# Altium schematic sheet LED_Array.SchDoc
size A4
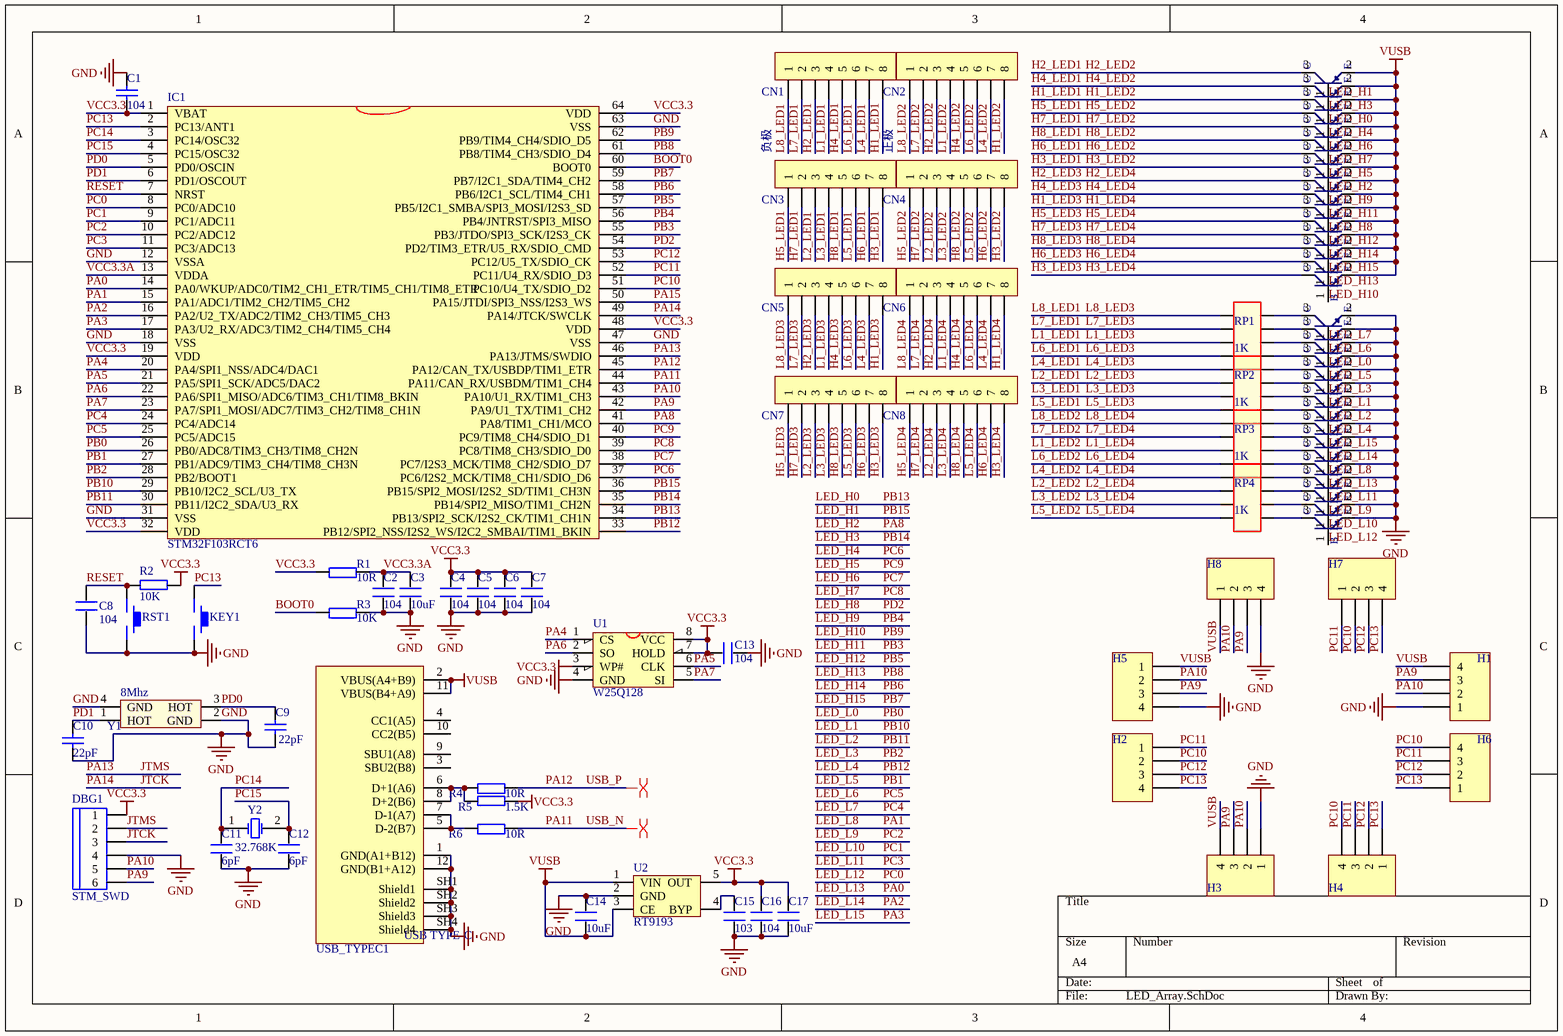
[diagram p0: LED_Array.SchDoc]

## Parts
C1  104  [C 0603_L]
C2  104  [C 0603_L]
C3  10uF  [C 0603_L]
C4  104  [C 0603_L]
C5  104  [C 0603_L]
C6  104  [C 0603_L]
C7  104  [C 0603_L]
C8  104  [C 0603_L]
C9  22pF  [C 0603_L]
C10  22pF  [C 0603_L]
C11  6pF  [C 0603_L]
C12  6pF  [C 0603_L]
C13  104  [C 0603_L]
C14  10uF  [C 0603_L]
C15  103  [C 0603_L]
C16  104  [C 0603_L]
C17  10uF  [C 0603_L]
CN1  HDR-1X8  [HDR2.54-Y-LI-8P]  (value not drawn)
CN2  HDR-1X8  [HDR2.54-Y-LI-8P]  (value not drawn)
CN3  HDR-1X8  [HDR2.54-Y-LI-8P]  (value not drawn)
CN4  HDR-1X8  [HDR2.54-Y-LI-8P]  (value not drawn)
CN5  HDR-1X8  [HDR2.54-Y-LI-8P]  (value not drawn)
CN6  HDR-1X8  [HDR2.54-Y-LI-8P]  (value not drawn)
CN7  HDR-1X8  [HDR2.54-Y-LI-8P]  (value not drawn)
CN8  HDR-1X8  [HDR2.54-Y-LI-8P]  (value not drawn)
DBG1  STM_SWD  [SH1.0 S-W-6P]
H1  Header 4  [HDR2.54-WI-4P]  (value not drawn)
H2  Header 4  [HDR2.54-WI-4P]  (value not drawn)
H3  Header 4  [HDR2.54-WI-4P]  (value not drawn)
H4  Header 4  [HDR2.54-WI-4P]  (value not drawn)
H5  Header 4  [HDR2.54-WI-4P]  (value not drawn)
H6  Header 4  [HDR2.54-WI-4P]  (value not drawn)
H7  Header 4  [HDR2.54-WI-4P]  (value not drawn)
H8  Header 4  [HDR2.54-WI-4P]  (value not drawn)
IC1  STM32F103RCT6  [LQFP64 10X10_L]
KEY1  KEY-SMD  [TSW SMD-3*6*2.5]  (value not drawn)
Q1  8550  [SOT23-3L]  (value not drawn)
Q2  8550  [SOT23-3L]  (value not drawn)
Q3  8550  [SOT23-3L]  (value not drawn)
Q4  8550  [SOT23-3L]  (value not drawn)
Q5  8550  [SOT23-3L]  (value not drawn)
Q6  8550  [SOT23-3L]  (value not drawn)
Q7  8550  [SOT23-3L]  (value not drawn)
Q8  8550  [SOT23-3L]  (value not drawn)
Q9  8550  [SOT23-3L]  (value not drawn)
Q10  8550  [SOT23-3L]  (value not drawn)
Q11  8550  [SOT23-3L]  (value not drawn)
Q12  8550  [SOT23-3L]  (value not drawn)
Q13  8550  [SOT23-3L]  (value not drawn)
Q14  8550  [SOT23-3L]  (value not drawn)
Q15  8550  [SOT23-3L]  (value not drawn)
Q16  8550  [SOT23-3L]  (value not drawn)
Q17  8050  [SOT23-3L]  (value not drawn)
Q18  8050  [SOT23-3L]  (value not drawn)
Q19  8050  [SOT23-3L]  (value not drawn)
Q20  8050  [SOT23-3L]  (value not drawn)
Q21  8050  [SOT23-3L]  (value not drawn)
Q22  8050  [SOT23-3L]  (value not drawn)
Q23  8050  [SOT23-3L]  (value not drawn)
Q24  8050  [SOT23-3L]  (value not drawn)
Q25  8050  [SOT23-3L]  (value not drawn)
Q26  8050  [SOT23-3L]  (value not drawn)
Q27  8050  [SOT23-3L]  (value not drawn)
Q28  8050  [SOT23-3L]  (value not drawn)
Q29  8050  [SOT23-3L]  (value not drawn)
Q30  8050  [SOT23-3L]  (value not drawn)
Q31  8050  [SOT23-3L]  (value not drawn)
Q32  8050  [SOT23-3L]  (value not drawn)
R1  10R  [R 0603_L]
R2  10K  [R 0603_L]
R3  10K  [R 0603_L]
R4  10R  [R 0603_L]
R5  1.5K  [R 0603_L]
R6  10R  [R 0603_L]
RP1  1K  [P_pack]
RP2  1K  [P_pack]
RP3  1K  [P_pack]
RP4  1K  [P_pack]
RST1  KEY-SMD  [TSW SMD-3*6*2.5]  (value not drawn)
U1  W25Q128  [SOP8W_L]
U2  RT9193  [SOT23-5L]
USB_TYPEC1  USB TypeC  [USB Type-C]  (value not drawn)
Y1  8Mhz  [XTAL-3225-4P]
Y2  32.768K  [OSC 3215-2P]

## Nets
GND: C1.1 C2.1 C3.1 C4.1 C5.1 C6.1 C7.1 C8.1 C9.1 C10.1 C11.1 C12.1 C13.2 C14.2 C15.1 C16.1 C17.1 DBG1.4 H1.1 H3.1 H5.4 H8.4 IC1.12(VSSA) IC1.18(VSS) IC1.31(VSS) IC1.47(VSS) IC1.63(VSS) KEY1.2 Q17.2(E) Q18.2(E) Q19.2(E) Q20.2(E) Q21.2(E) Q22.2(E) Q23.2(E) Q24.2(E) Q25.2(E) Q26.2(E) Q27.2(E) Q28.2(E) Q29.2(E) Q30.2(E) Q31.2(E) Q32.2(E) R3.2 RST1.2 U1.4(GND) U2.2(GND) USB_TYPEC1.1(GND(A1+B12)) USB_TYPEC1.12(GND(B1+A12)) USB_TYPEC1.SH1(Shield1) USB_TYPEC1.SH2(Shield2) USB_TYPEC1.SH3(Shield3) USB_TYPEC1.SH4(Shield4) Y1.2(GND) Y1.4(GND)
VCC3.3: C1.2 C4.2 C5.2 C6.2 C7.2 C13.1 C16.2 C17.2 DBG1.1 IC1.1(VBAT) IC1.19(VDD) IC1.32(VDD) IC1.48(VDD) IC1.64(VDD) R1.1 R2.1 R5.1 U1.3(WP#) U1.7(HOLD) U1.8(VCC) U2.5(OUT)
VUSB: C14.1 H1.4 H3.4 H5.1 H8.1 Q1.2(E) Q2.2(E) Q3.2(E) Q4.2(E) Q5.2(E) Q6.2(E) Q7.2(E) Q8.2(E) Q9.2(E) Q10.2(E) Q11.2(E) Q12.2(E) Q13.2(E) Q14.2(E) Q15.2(E) Q16.2(E) U2.1(VIN) U2.3(CE) USB_TYPEC1.2(VBUS(A4+B9)) USB_TYPEC1.11(VBUS(B4+A9))
BOOT0: IC1.60(BOOT0) R3.1
H1_LED1: CN1.8 CN2.8 Q3.3(C)  [also labelled H1_LED2]
H1_LED3: CN5.8 CN6.8 Q11.3(C)  [also labelled H1_LED4]
H2_LED1: CN1.3 CN2.3 Q1.3(C)  [also labelled H2_LED2]
H2_LED3: CN5.3 CN6.3 Q9.3(C)  [also labelled H2_LED4]
H3_LED1: CN3.8 CN4.8 Q8.3(C)  [also labelled H3_LED2]
H3_LED3: CN7.8 CN8.8 Q16.3(C)  [also labelled H3_LED4]
H4_LED1: CN1.5 CN2.5 Q2.3(C)  [also labelled H4_LED2]
H4_LED3: CN5.5 CN6.5 Q10.3(C)  [also labelled H4_LED4]
H5_LED1: CN3.1 CN4.1 Q4.3(C)  [also labelled H5_LED2]
H5_LED3: CN7.1 CN8.1 Q12.3(C)  [also labelled H5_LED4]
H6_LED1: CN3.7 CN4.7 Q7.3(C)  [also labelled H6_LED2]
H6_LED3: CN7.7 CN8.7 Q15.3(C)  [also labelled H6_LED4]
H7_LED1: CN3.2 CN4.2 Q5.3(C)  [also labelled H7_LED2]
H7_LED3: CN7.2 CN8.2 Q13.3(C)  [also labelled H7_LED4]
H8_LED1: CN3.5 CN4.5 Q6.3(C)  [also labelled H8_LED2]
H8_LED3: CN7.5 CN8.5 Q14.3(C)  [also labelled H8_LED4]
JTCK: DBG1.3 IC1.49(PA14/JTCK/SWCLK)  [also labelled PA14]
JTMS: DBG1.2 IC1.46(PA13/JTMS/SWDIO)  [also labelled PA13]
L1_LED1: CN1.4 CN5.4 RP1.5  [also labelled L1_LED3]
L1_LED2: CN2.4 CN6.4 RP3.5  [also labelled L1_LED4]
L2_LED1: CN3.3 CN7.3 RP2.3  [also labelled L2_LED3]
L2_LED2: CN4.3 CN8.3 RP4.3  [also labelled L2_LED4]
L3_LED1: CN3.4 CN7.4 RP2.5  [also labelled L3_LED3]
L3_LED2: CN4.4 CN8.4 RP4.5  [also labelled L3_LED4]
L4_LED1: CN1.7 CN5.7 RP2.1  [also labelled L4_LED3]
L4_LED2: CN2.7 CN6.7 RP4.1  [also labelled L4_LED4]
L5_LED1: CN3.6 CN7.6 RP2.7  [also labelled L5_LED3]
L5_LED2: CN4.6 CN8.6 RP4.7  [also labelled L5_LED4]
L6_LED1: CN1.6 CN5.6 RP1.7  [also labelled L6_LED3]
L6_LED2: CN2.6 CN6.6 RP3.7  [also labelled L6_LED4]
L7_LED1: CN1.2 CN5.2 RP1.3  [also labelled L7_LED3]
L7_LED2: CN2.2 CN6.2 RP3.3  [also labelled L7_LED4]
L8_LED1: CN1.1 CN5.1 RP1.1  [also labelled L8_LED3]
L8_LED2: CN2.1 CN6.1 RP3.1  [also labelled L8_LED4]
LED_H0: IC1.34(PB13/SPI2_SCK/I2S2_CK/TIM1_CH1N) Q3.1(B)  [also labelled PB13]
LED_H1: IC1.36(PB15/SPI2_MOSI/I2S2_SD/TIM1_CH3N) Q1.1(B)  [also labelled PB15]
LED_H2: IC1.41(PA8/TIM1_CH1/MCO) Q8.1(B)  [also labelled PA8]
LED_H3: IC1.35(PB14/SPI2_MISO/TIM1_CH2N) Q2.1(B)  [also labelled PB14]
LED_H4: IC1.37(PC6/I2S2_MCK/TIM8_CH1/SDIO_D6) Q4.1(B)  [also labelled PC6]
LED_H5: IC1.40(PC9/TIM8_CH4/SDIO_D1) Q7.1(B)  [also labelled PC9]
LED_H6: IC1.38(PC7/I2S3_MCK/TIM8_CH2/SDIO_D7) Q5.1(B)  [also labelled PC7]
LED_H7: IC1.39(PC8/TIM8_CH3/SDIO_D0) Q6.1(B)  [also labelled PC8]
LED_H8: IC1.54(PD2/TIM3_ETR/U5_RX/SDIO_CMD) Q11.1(B)  [also labelled PD2]
LED_H9: IC1.56(PB4/JNTRST/SPI3_MISO) Q9.1(B)  [also labelled PB4]
LED_H10: IC1.62(PB9/TIM4_CH4/SDIO_D5) Q16.1(B)  [also labelled PB9]
LED_H11: IC1.55(PB3/JTDO/SPI3_SCK/I2S3_CK) Q10.1(B)  [also labelled PB3]
LED_H12: IC1.57(PB5/I2C1_SMBA/SPI3_MOSI/I2S3_SD) Q12.1(B)  [also labelled PB5]
LED_H13: IC1.61(PB8/TIM4_CH3/SDIO_D4) Q15.1(B)  [also labelled PB8]
LED_H14: IC1.58(PB6/I2C1_SCL/TIM4_CH1) Q13.1(B)  [also labelled PB6]
LED_H15: IC1.59(PB7/I2C1_SDA/TIM4_CH2) Q14.1(B)  [also labelled PB7]
LED_L0: IC1.26(PB0/ADC8/TIM3_CH3/TIM8_CH2N) Q19.1(B)  [also labelled PB0]
LED_L1: IC1.29(PB10/I2C2_SCL/U3_TX) Q22.1(B)  [also labelled PB10]
LED_L2: IC1.30(PB11/I2C2_SDA/U3_RX) Q23.1(B)  [also labelled PB11]
LED_L3: IC1.28(PB2/BOOT1) Q21.1(B)  [also labelled PB2]
LED_L4: IC1.33(PB12/SPI2_NSS/I2S2_WS/I2C2_SMBAI/TIM1_BKIN) Q24.1(B)  [also labelled PB12]
LED_L5: IC1.27(PB1/ADC9/TIM3_CH4/TIM8_CH3N) Q20.1(B)  [also labelled PB1]
LED_L6: IC1.25(PC5/ADC15) Q18.1(B)  [also labelled PC5]
LED_L7: IC1.24(PC4/ADC14) Q17.1(B)  [also labelled PC4]
LED_L8: IC1.15(PA1/ADC1/TIM2_CH2/TIM5_CH2) Q27.1(B)  [also labelled PA1]
LED_L9: IC1.10(PC2/ADC12) Q30.1(B)  [also labelled PC2]
LED_L10: IC1.9(PC1/ADC11) Q31.1(B)  [also labelled PC1]
LED_L11: IC1.11(PC3/ADC13) Q29.1(B)  [also labelled PC3]
LED_L12: IC1.8(PC0/ADC10) Q32.1(B)  [also labelled PC0]
LED_L13: IC1.14(PA0/WKUP/ADC0/TIM2_CH1_ETR/TIM5_CH1/TIM8_ETR) Q28.1(B)  [also labelled PA0]
LED_L14: IC1.16(PA2/U2_TX/ADC2/TIM2_CH3/TIM5_CH3) Q26.1(B)  [also labelled PA2]
LED_L15: IC1.17(PA3/U2_RX/ADC3/TIM2_CH4/TIM5_CH4) Q25.1(B)  [also labelled PA3]
PA4: IC1.20(PA4/SPI1_NSS/ADC4/DAC1) U1.1(CS)
PA5: IC1.21(PA5/SPI1_SCK/ADC5/DAC2) U1.6(CLK)
PA6: IC1.22(PA6/SPI1_MISO/ADC6/TIM3_CH1/TIM8_BKIN) U1.2(SO)
PA7: IC1.23(PA7/SPI1_MOSI/ADC7/TIM3_CH2/TIM8_CH1N) U1.5(SI)
PA9: DBG1.6 H1.3 H3.3 H5.3 H8.3 IC1.42(PA9/U1_TX/TIM1_CH2)
PA10: DBG1.5 H1.2 H3.2 H5.2 H8.2 IC1.43(PA10/U1_RX/TIM1_CH3)
PA11: IC1.44(PA11/CAN_RX/USBDM/TIM1_CH4) R6.2  [also labelled USB_N]
PA12: IC1.45(PA12/CAN_TX/USBDP/TIM1_ETR) R4.2  [also labelled USB_P]
PA15: IC1.50(PA15/JTDI/SPI3_NSS/I2S3_WS)
PC10: H2.2 H4.4 H6.4 H7.2 IC1.51(PC10/U4_TX/SDIO_D2)
PC11: H2.1 H4.3 H6.3 H7.1 IC1.52(PC11/U4_RX/SDIO_D3)
PC12: H2.3 H4.2 H6.2 H7.3 IC1.53(PC12/U5_TX/SDIO_CK)
PC13: H2.4 H4.1 H6.1 H7.4 IC1.2(PC13/ANT1) KEY1.1
PC14: C11.2 IC1.3(PC14/OSC32) Y2.1(OSC1)
PC15: C12.2 IC1.4(PC15/OSC32) Y2.2(OSC2)
PD0: C9.2 IC1.5(PD0/OSCIN) Y1.3(HOT)
PD1: C10.2 IC1.6(PD1/OSCOUT) Y1.1(HOT)
RESET: C8.2 IC1.7(NRST) R2.2 RST1.1
VCC3.3A: C2.2 C3.2 IC1.13(VDDA) R1.2
NetC15_2: C15.2 U2.4(BYP)
NetQ17_3: Q17.3(C) RP1.2
NetQ18_3: Q18.3(C) RP1.4
NetQ19_3: Q19.3(C) RP1.6
NetQ20_3: Q20.3(C) RP1.8
NetQ21_3: Q21.3(C) RP2.2
NetQ22_3: Q22.3(C) RP2.4
NetQ23_3: Q23.3(C) RP2.6
NetQ24_3: Q24.3(C) RP2.8
NetQ25_3: Q25.3(C) RP3.2
NetQ26_3: Q26.3(C) RP3.4
NetQ27_3: Q27.3(C) RP3.6
NetQ28_3: Q28.3(C) RP3.8
NetQ29_3: Q29.3(C) RP4.2
NetQ30_3: Q30.3(C) RP4.4
NetQ31_3: Q31.3(C) RP4.6
NetQ32_3: Q32.3(C) RP4.8
NetR4_1: R4.1 R5.2 USB_TYPEC1.6(D+1(A6)) USB_TYPEC1.8(D+2(B6))
NetR6_1: R6.1 USB_TYPEC1.5(D-2(B7)) USB_TYPEC1.7(D-1(A7))

Not connected (* = marked no-connect by the designer): USB_TYPEC1 3(SBU2(B8)) 4(CC1(A5)) 9(SBU1(A8)) 10(CC2(B5))

## Layout directives
differential pair: PA11, PA12

## Notes on the sheet
- (near CN3) 负极
- 正极
- (in symbol USB Type-C) USB TYPE-C

## Library data of the parts
C1 C9 C10 = CAP
C2-C8 C11-C17 = C
CN1-CN8 = Header 8: 8P接插件; BOM名称: 8P接插件
DBG1 = HEAD6
H1-H8 = Header 4: Header, 4-Pin; LatestRevisionDate: 17-Jul-2002; LatestRevisionNote: Re-released for DXP Platform.; Publisher: Altium Limited
IC1 = STM32F103RDT6
KEY1 RST1 = S-KEY-SMD-324225: KEY,SMD,324225
Q1-Q16 = 8550PNP
Q17-Q32 = 8050NPN
R1-R6 = R
RP1-RP4 = R_pack: 贴片排阻
U1 = W25X16: W25X16;SST25VF016;MX25L1605
U2 = CAT6219-330TD: 3.3V 500mA LDO
USB_TYPEC1 = USB Type-C: 12P TypeC 母座
Y1 = XTAL_3225: 3225贴片无源晶振
Y2 = XTAL: Crystal Oscillator; Published: 8-Jun-2000; LatestRevisionDate: 17-Jul-2002; LatestRevisionNote: Re-released for DXP Platform.; Publisher: Altium Limited